# Altium project Carte_test_JLC.PrjPcb
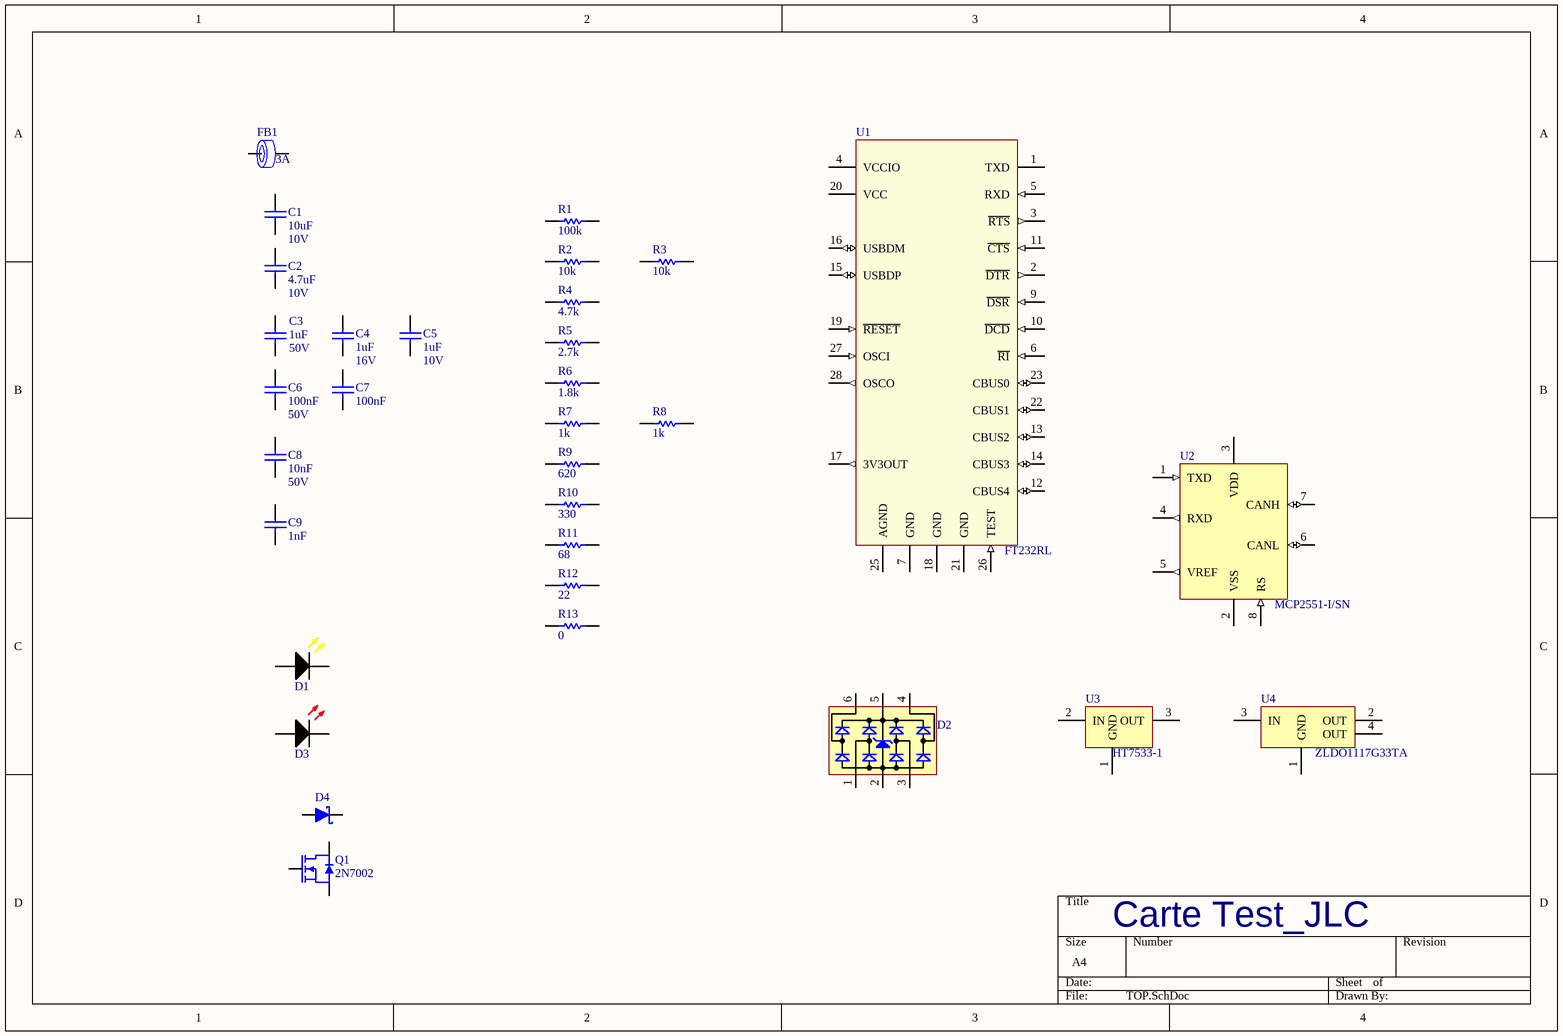
[diagram p0: TOP.SchDoc]
1 sheet, 32 parts. Net scope: global (net labels, ports and power ports of the same name join across sheets).
Board file: Carte_test_JLC.PcbDoc

## Sheet TOP.SchDoc
size A4; Author: Audran; CompanyName: Goldorak; Address1: Electrolab; Address2: 52 rue Paul Lescop; Address3: 92000 Nanterre; DocumentNumber: 1; SheetNumber: 1; SheetTotal: 8; ProjectName: Cartes_2017

### Parts
C1  10uF  RatedVoltage: 10V  [WCAP-CSGP_0805, 2x1.25x1.25]
C2  4.7uF  RatedVoltage: 10V  [WCAP-CSGP_0603, 1.6x0.8x0.8]
C3  1uF  RatedVoltage: 50V  [WCAP-CSGP_0805, 2x1.25x1.25]
C4  1uF  RatedVoltage: 16V  [WCAP-CSGP_0603, 1.6x0.8x0.8]
C5  1uF  RatedVoltage: 10V  [WCAP-CSGP_0402, 1x0.5x0.5]
C6  100nF  RatedVoltage: 50V  [WCAP-CSGP_0603, 1.6x0.8x0.8]
C7  100nF  [WCAP-CSGP_0402, 1x0.5x0.5]
C8  10nF  RatedVoltage: 50V  [WCAP-CSGP_0402, 1x0.5x0.5]
C9  1nF  [WCAP-CSGP_0402, 1x0.5x0.5]
D1  150060YS75000  [SMCW_0603]  (value not drawn)
D2  824001  [SOT-23-6L]  (value not drawn)
D3  150060RS75000  [SMCW_0603]  (value not drawn)
D4  RBR3MM40ATFTR  [SOD-123FL]  (value not drawn)
FB1  RatedCurrent: 3A  [WE-CBF_0805_High Current]  (hidden comment: 742792023)
Q1  2N7002  [SOT-23]
R1  value 100k  [RESC1005X04N]  (hidden comment: RC0402FR-07100KL)
R2  value 10k  [RESC1005X04N]  (hidden comment: RC0402FR-0710KL)
R3  value 10k  [RESC1608X06N]  (hidden comment: RC0603FR-0710KL)
R4  value 4.7k  [RESC1005X04N]  (hidden comment: RC0402FR-074K7L)
R5  value 2.7k  [RESC2012X06N]  (hidden comment: RC0805FR-072K7L)
R6  value 1.8k  [RESC1608X06N]  (hidden comment: RC0603FR-071K8L)
R7  value 1k  [RESC1005X04N]  (hidden comment: RC0402FR-071KL)
R8  value 1k  [RESC1608X06N]  (hidden comment: RC0603FR-071KL)
R9  value 620  [RESC1608X06N]  (hidden comment: RC0603FR-07620RL)
R10  value 330  [RESC1005X04N]  (hidden comment: RC0402FR-07330RL)
R11  value 68  [RESC1608X06N]  (hidden comment: RC0603FR-0768RL)
R12  value 22  [RESC1005X04N]  (hidden comment: RC0402FR-0722RL)
R13  value 0  [RESC1608X06N]  (hidden comment: RC0603FR-070RL)
U1  FT232RL  [SSOP28]
U2  MCP2551-I/SN  [SOIC127P600X175-8N]
U3  HT7533-1  [SOT89-150P350X160-3N]
U4  ZLDO1117G33TA  [SOT223]

### Nets

Not connected (* = marked no-connect by the designer): C1 1 2; C2 1 2; C3 1 2; C4 1 2; C5 1 2; C6 1 2; C7 1 2; C8 1 2; C9 1 2; D1 1(C) 2(A); D2 1 2 3 4 5 6; D3 1(C) 2(A); D4 1 2; FB1 1 2; Q1 1(G) 2(S) 3(D); R1 1 2; R2 1 2; R3 1 2; R4 1 2; R5 1 2; R6 1 2; R7 1 2; R8 1 2; R9 1 2; R10 1 2; R11 1 2; R12 1 2; R13 1 2; U1 1(TXD) 2(~{DTR}) 3(~{RTS}) 4(VCCIO) 5(RXD) 6(~{RI}) 7(GND) 9(~{DSR}) 10(~{DCD}) 11(~{CTS}) 12(CBUS4) 13(CBUS2) 14(CBUS3) 15(USBDP) 16(USBDM) 17(3V3OUT) 18(GND) 19(~{RESET}) 20(VCC) 21(GND) 22(CBUS1) 23(CBUS0) 25(AGND) 26(TEST) 27(OSCI) 28(OSCO); U2 1(TXD) 2(VSS) 3(VDD) 4(RXD) 5(VREF) 6(CANL) 7(CANH) 8(RS); U3 1(GND) 2(IN) 3(OUT); U4 1(GND) 2(OUT) 3(IN) 4(OUT)

### Notes on the sheet
- Carte Test_JLC

### Library data of the parts
C1 = WCAP-CSGP, 885012207026: CAP CER 10uF 10V X7R 0805; Manufacturer: Wurth Elektronik; ComponentLink1Description: Datasheet; ComponentLink1URL: http://katalog.we-online.com/pbs/datasheet/885012207026.pdf; Manufacturer Part Number: 885012207026; Value: 10uF; Size: 0805; CeramicType: X7R; Supplier 1: Farnell; Supplier Part Number 1: 2495189; Supplier Part Number 2: C15850; Supplier 2: JLCPCB; Supplier Footprint 2: 0805
C2 = WCAP-CSGP, 885012106012: CAP CER 4.7UF 10V X5R 0603; Manufacturer: Wurth Elektronik; ComponentLink1Description: Datasheet; ComponentLink1URL: http://katalog.we-online.com/pbs/datasheet/885012106012.pdf; Manufacturer Part Number: 885012106012; Value: 4.7uF; Size: 0603; CeramicType: X5R; Supplier 2: JLCPCB; Supplier Part Number 2: C19666; Supplier Footprint 2: 0603
C3 = WCAP-CSGP, 885012207103: CAP CER 1uF 50V X7R 0805; Manufacturer: Wurth Elektronik; ComponentLink1Description: Datasheet; ComponentLink1URL: http://katalog.we-online.com/pbs/datasheet/885012207103.pdf; Manufacturer Part Number: 885012207103; Value: 1uF; Size: 0805; CeramicType: X7R; Supplier 2: JLCPCB; Supplier Part Number 2: C28323; Supplier Footprint 2: 0805
C4 = WCAP-CSGP, 885012106017: CAP CER 1UF 16V X5R 0603; Manufacturer: Wurth Elektronik; ComponentLink1Description: Datasheet; ComponentLink1URL: http://katalog.we-online.com/pbs/datasheet/885012106017.pdf; Manufacturer Part Number: 885012106017; Value: 1uF; Size: 0603; CeramicType: X5R; Supplier 2: JLCPCB; Supplier Part Number 2: C15849; Supplier Footprint 2: 0603
C5 = WCAP-CSGP, 885012105012: CAP CER 1UF 10V X5R 0402; Manufacturer: Wurth Elektronik; ComponentLink1Description: Datasheet; ComponentLink1URL: http://katalog.we-online.com/pbs/datasheet/885012105012.pdf; Manufacturer Part Number: 885012105012; Value: 1uF; Size: 0402; CeramicType: X5R; Supplier 2: JLCPCB; Supplier Part Number 2: C52923; Supplier Footprint 2: 0402
C6 = WCAP-CSGP, 885012206095: CAP CER 100nF 50V X7R 0603; Manufacturer: Wurth Elektronik; ComponentLink1Description: Datasheet; ComponentLink1URL: http://katalog.we-online.com/pbs/datasheet/885012206095.pdf; Value: 100nF; Size: 0603; CeramicType: X7R; Manufacturer Part Number: 885012206095; Supplier 2: JLCPCB; Supplier Part Number 2: C14663; Supplier Footprint 2: 0603
C7 = WCAP-CSGP, 885012205037: CAP CER 100nF 16V X7R 0402; Manufacturer: Wurth Elektronik; ComponentLink1Description: Datasheet; ComponentLink1URL: http://katalog.we-online.com/pbs/datasheet/885012205037.pdf; Manufacturer Part Number: 885012205037; Value: 100nF; Size: 0402; CeramicType: X7R; RatedVoltage: 16V; Supplier 2: JLCPCB; Supplier Part Number 2: C1525; Supplier Footprint 2: 0402
C8 = WCAP-CSGP, 885012205067: CAP CER 10nF 50V X7R 0402; Manufacturer: Wurth Elektronik; ComponentLink1Description: Datasheet; ComponentLink1URL: http://katalog.we-online.com/pbs/datasheet/885012205067.pdf; Manufacturer Part Number: 885012205067; Value: 10nF; Size: 0402; CeramicType: X7R; Supplier 2: JLCPCB; Supplier Part Number 2: C15195; Supplier Footprint 2: 0402
C9 = WCAP-CSGP, 885012205061: CAP CER 1nF 50V X7R 0402; Manufacturer: Wurth Elektronik; ComponentLink1Description: Datasheet; ComponentLink1URL: http://katalog.we-online.com/pbs/datasheet/885012205061.pdf; Manufacturer Part Number: 885012205061; Value: 1nF; Size: 0402; CeramicType: X7R; RatedVoltage: 50V; Supplier 2: JLCPCB; Supplier Part Number 2: C1523; Supplier Footprint 2: 0402
D1 = WL-SMCW 0603  150060YS75000: SMD mono-color Chip LED, WL-SMCW, Yellow; Manufacturer: Wurth Elektronik; Value: Jaune; Manufacturer Part Number: 150060YS75000; ComponentLink1Description: Datasheet; ComponentLink1URL: http://katalog.we-online.com/led/datasheet/150060YS75000.pdf; Supplier 1: Farnell; Supplier Part Number 1: 2322074; Supplier 2: JLCPCB; Supplier Part Number 2: C72038; Supplier Footprint 2: LED_0603
D2 = 824001: WE-TVS TVS Diode 4+1Ch 5V SOT23-6L; Manufacturer: Wurth Elektronik; ComponentLink1Description: Datasheet; ComponentLink1URL: https://www.we-online.com/catalog/datasheet/824001.pdf; Manufacturer Part Number: 824001; Supplier 1: Farnell; Supplier Part Number 1: 1748613; Type: TVS; Value: 5V; Supplier 2: JLCPCB; Supplier Part Number 2: C85364; Supplier Footprint 2: SOT-23-6L
D3 = WL-SMCW 0603  150060RS75000: SMD mono-color Chip LED, WL-SMCW, Red; Manufacturer: Wurth Elektronik; Value: Rouge; Manufacturer Part Number: 150060RS75000; ComponentLink1Description: Datasheet; ComponentLink1URL: http://katalog.we-online.com/led/datasheet/150060RS75000.pdf; Supplier 1: Farnell; Supplier Part Number 1: 2322071; Supplier 2: JLCPCB; Supplier Part Number 2: C2286; Supplier Footprint 2: LED_0603
D4 = RBR3MM40ATFTR: DIODE SCHOTTKY 40V 3A SOD123-FL; Manufacturer: ROHM; Supplier 1: Farnell; Manufacturer Part Number: RBR3MM40ATFTR; ComponentLink1URL: http://www.farnell.com/datasheets/2067190.pdf; ComponentLink1Description: Datasheet; Supplier Part Number 1: 2581593; ComponentLink2Description: Manufacturer; ComponentLink2URL: http://www.rohm.com/web/global/products/-/product/RBR3MM40ATF; ContinuousForwardCurrent: 3A; Type: Schottky; Supplier 2: JLCPCB; Supplier Part Number 2: C8598; Value: 40V; Supplier Footprint 2: SOD-123
FB1 = WE-CBF, 742792023: Ferrite Bead 120ohm 0805 3A; Manufacturer: Wurth Elektronik; Value: 120; ComponentLink1Description: Manufacturer; ComponentLink1URL: https://www.we-online.com/catalog/en/WE-CBF/?sq=742792023#742792023; ComponentLink2Description: Datasheet; ComponentLink2URL: https://www.we-online.com/catalog/datasheet/742792023.pdf; Manufacturer Part Number: 742792023; Supplier 2: JLCPCB; Supplier Part Number 2: C1015; Supplier 1: Farnell; Supplier Part Number 1: 1635732; Supplier Footprint 2: 0805
Q1 = 2N7002: MOSFET N 60V 115MA SOT23; Manufacturer: Changjiang Electronics Tech (CJ); Supplier 1: Farnell; Supplier Part Number 1: 1510761; Manufacturer Part Number: 2N7002; ComponentLink1Description: Datasheet; ComponentLink1URL: https://datasheet.lcsc.com/szlcsc/1810151612_Changjiang-Electronics-Tech-CJ-2N7002_C8545.pdf; Supplier 2: JLCPCB; Supplier Part Number 2: C8545; Supplier Footprint 2: SOT-23-3
R1 = RC0402FR-07100KL: RES SMD 100K OHM 1% 1/16W 0402; Manufacturer: Yageo; Power: 63mW; Vmax: 50V; Type: Thick Film; ComponentLink1Description: Manufacturer; ComponentLink1URL: http://www.yageo.com/NewPortal/_en/index.jsp; ComponentLink2Description: Datasheet; ComponentLink2URL: http://www.farnell.com/datasheets/2167052.pdf; Manufacturer Part Number: RC0402FR-07100KL; Supplier 1: Farnell; Supplier Part Number 1: 9239472; Precision: ±1%; Supplier 2: JLCPCB; Supplier Part Number 2: C25741; Supplier Footprint 2: 0402
R2 = RC0402FR-0710KL: RES SMD 10K OHM 1% 1/16W 0402; Manufacturer: Yageo; Power: 63mW; Vmax: 50V; Type: Thick Film; ComponentLink1Description: Manufacturer; ComponentLink1URL: http://www.yageo.com/NewPortal/_en/index.jsp; ComponentLink2Description: Datasheet; ComponentLink2URL: http://www.farnell.com/datasheets/2167052.pdf; Supplier 1: Farnell; Supplier Part Number 1: 9239359; Manufacturer Part Number: RC0402FR-0710KL; Precision: ±1%; Supplier 2: JLCPCB; Supplier Part Number 2: C25744; Supplier Footprint 2: 0402
R3 = RC0603FR-0710KL: RES SMD 10K OHM 1% 1/10W 0603; Manufacturer: Yageo; Power: 100mW; Vmax: 50V; Manufacturer Part Number: RC0603FR-0710KL; Type: Thick Film; ComponentLink1Description: Manufacturer; ComponentLink1URL: http://www.yageo.com/NewPortal/_en/index.jsp; ComponentLink2Description: Datasheet; ComponentLink2URL: http://www.farnell.com/datasheets/2167052.pdf; Supplier 1: Farnell; Supplier Part Number 1: 9238603; Precision: ±1%; Supplier 2: JLCPCB; Supplier Part Number 2: C25804; Supplier Footprint 2: 0603
R4 = RC0402FR-074K7L: RES SMD 4K7 OHM 1% 1/16W 0402; Manufacturer: Yageo; Power: 63mW; Vmax: 50V; Type: Thick Film; ComponentLink1Description: Manufacturer; ComponentLink1URL: http://www.yageo.com/NewPortal/_en/index.jsp; ComponentLink2Description: Datasheet; ComponentLink2URL: http://www.farnell.com/datasheets/2167052.pdf; Manufacturer Part Number: RC0402FR-074K7L; Supplier 1: Farnell; Supplier Part Number 1: 9239316; Precision: ±1%; Supplier 2: JLCPCB; Supplier Part Number 2: C25900; Supplier Footprint 2: 0402
R5 = RC0805FR-072K7L: RES SMD 2K7 OHM 1% 1/8W 0805; Manufacturer: Yageo; Power: 125mW; Vmax: 50V; Manufacturer Part Number: RC0805FR-072K7L; Type: Thick Film; ComponentLink1Description: Manufacturer; ComponentLink1URL: http://www.yageo.com/NewPortal/_en/index.jsp; ComponentLink2Description: Datasheet; ComponentLink2URL: http://www.farnell.com/datasheets/444164.pdf; Supplier 1: Farnell; Supplier Part Number 1: 9237666; Precision: ±1%; Supplier 2: JLCPCB; Supplier Part Number 2: C17530; Supplier Footprint 2: 0805
R6 = RC0603FR-071K8L: RES SMD 1.8K OHM 1% 1/10W 0603; Manufacturer: Yageo; Power: 100mW; Vmax: 50V; Manufacturer Part Number: RC0603FR-071K8L; Type: Thick Film; ComponentLink1Description: Manufacturer; ComponentLink1URL: http://www.yageo.com/NewPortal/_en/index.jsp; ComponentLink2Description: Datasheet; ComponentLink2URL: http://www.farnell.com/datasheets/2167052.pdf; Precision: ±1%; Supplier 1: Farnell; Supplier Part Number 1: 9238514; Supplier 2: JLCPCB; Supplier Part Number 2: C4177; Supplier Footprint 2: 0603
R7 = RC0402FR-071KL: RES SMD 1K OHM 1% 1/16W 0402; Manufacturer: Yageo; Power: 63mW; Vmax: 50V; Type: Thick Film; ComponentLink1Description: Manufacturer; ComponentLink1URL: http://www.yageo.com/NewPortal/_en/index.jsp; ComponentLink2Description: Datasheet; ComponentLink2URL: http://www.farnell.com/datasheets/2167052.pdf; Manufacturer Part Number: RC0402FR-071KL; Supplier 1: Farnell; Supplier Part Number 1: 9239235; Precision: ±1%; Supplier 2: JLCPCB; Supplier Part Number 2: C11702; Supplier Footprint 2: 0402
R8 = RC0603FR-071KL: RES SMD 1K OHM 1% 1/10W 0603; Manufacturer: Yageo; Power: 100mW; Vmax: 50V; Manufacturer Part Number: RC0603FR-071KL; Type: Thick Film; ComponentLink1Description: Manufacturer; ComponentLink1URL: http://www.yageo.com/NewPortal/_en/index.jsp; ComponentLink2Description: Datasheet; ComponentLink2URL: http://www.farnell.com/datasheets/2167052.pdf; Precision: ±1%; Supplier 1: Farnell; Supplier Part Number 1: 9238484; Supplier 2: JLCPCB; Supplier Part Number 2: C21190; Supplier Footprint 2: 0603
R9 = RC0603FR-07620RL: RES SMD 620 OHM 1% 1/10W 0603; Manufacturer: Yageo; Power: 100mW; Vmax: 50V; Type: Thick Film; ComponentLink1Description: Manufacturer; ComponentLink1URL: http://www.yageo.com/NewPortal/_en/index.jsp; ComponentLink2Description: Datasheet; ComponentLink2URL: http://www.farnell.com/datasheets/1868787.pdf; Manufacturer Part Number: RC0603FR-07620RL; Precision: ±1%; Supplier 1: Digi-Key; Supplier Part Number 1: 311-620HRCT-ND; Supplier 2: JLCPCB; Supplier Part Number 2: C23220; Supplier Footprint 2: 0603
R10 = RC0402FR-07330RL: RES SMD 330 OHM 1% 1/16W 0402; Manufacturer: Yageo; Power: 63mW; Vmax: 50V; Type: Thick Film; ComponentLink1Description: Manufacturer; ComponentLink1URL: http://www.yageo.com/NewPortal/_en/index.jsp; ComponentLink2Description: Datasheet; ComponentLink2URL: http://www.farnell.com/datasheets/2167052.pdf; Manufacturer Part Number: RC0402FR-07330RL; Supplier 1: Farnell; Supplier Part Number 1: 9239170; Precision: ±1%; Supplier 2: JLCPCB; Supplier Part Number 2: C25104; Supplier Footprint 2: 0402
R11 = RC0603FR-0768RL: RES SMD 68 OHM 1% 1/10W 0603; Manufacturer: Yageo; Power: 100mW; Vmax: 50V; Manufacturer Part Number: RC0603FR-0768RL; Type: Thick Film; ComponentLink1Description: Manufacturer; ComponentLink1URL: http://www.yageo.com/NewPortal/_en/index.jsp; ComponentLink2Description: Datasheet; ComponentLink2URL: http://www.farnell.com/datasheets/1868787.pdf; Supplier 1: Farnell; Supplier Part Number 1: 9238344; Precision: ±1%; Supplier 2: JLCPCB; Supplier Part Number 2: C27592; Supplier Footprint 2: 0603
R12 = RC0402FR-0722RL: RES SMD 22 OHM 1% 1/16W 0402; Manufacturer: Yageo; Power: 63mW; Vmax: 50V; Type: Thick Film; ComponentLink1Description: Manufacturer; ComponentLink1URL: http://www.yageo.com/NewPortal/_en/index.jsp; ComponentLink2Description: Datasheet; ComponentLink2URL: http://www.farnell.com/datasheets/2167052.pdf; Manufacturer Part Number: RC0402FR-0722RL; Supplier 1: Farnell; Supplier Part Number 1: 9239030; Precision: ±1%; Supplier 2: JLCPCB; Supplier Part Number 2: C25092; Supplier Footprint 2: 0402
R13 = RC0603FR-070RL: RES SMD 0 OHM 1% 1/10W 0603; Manufacturer: Yageo; Power: 100mW; Vmax: 50V; Manufacturer Part Number: RC0603FR-070RL; Type: Thick Film; ComponentLink1Description: Manufacturer; ComponentLink1URL: http://www.yageo.com/NewPortal/_en/index.jsp; ComponentLink2Description: Datasheet; ComponentLink2URL: http://www.farnell.com/datasheets/2167052.pdf; Supplier 1: Farnell; Precision: ±1%; Supplier Part Number 1: 2309106; Supplier 2: JLCPCB; Supplier Part Number 2: C21189; Supplier Footprint 2: 0603
U1 = FT232RL: USB VERS UART CMS SSOP28 232; Manufacturer: FTDI; Manufacturer Part Number: FT232RL; Supplier 1: Farnell; Supplier Part Number 1: 1146032; ComponentLink1Description: Datasheet; ComponentLink1URL: http://www.farnell.com/datasheets/2007793.pdf; Supplier 2: JLCPCB; Supplier Footprint 2: SSOP-28_5.3x10.2x0.65P; Supplier Part Number 2: C8690
U2 = MCP2551-I/SN: IC TRANSCEIVER CAN HI-SPD 8-SOIC; Manufacturer: Microchip Technology; Manufacturer Part Number: MCP2551-I/SN; ComponentLink1Description: Datasheet; ComponentLink1URL: http://www.farnell.com/datasheets/657417.pdf; Supplier 1: Farnell; Supplier Part Number 1: 9758569; Supplier 2: JLCPCB; Supplier Part Number 2: C7439; Supplier Footprint 2: SOIC-8_3.9x4.9x1.27P
U3 = HT7533-1: LDO 3.3V 100mA SOT89; Manufacturer: Holtek; Manufacturer Part Number: HT7533-1; ComponentLink1URL: https://datasheet.lcsc.com/szlcsc/1812071811_Holtek-Semicon-HT7533-1_C14289.pdf; ComponentLink1Description: Datasheet; ComponentLink2Description: Manufacturer; ComponentLink2URL: https://www.holtek.com/productdetail/-/vg/75xx_1; Type: LDO; Value: 3.3V; Supplier 1: RSComponents; Supplier Part Number 1: 8850721; Supplier 2: JLCPCB; Supplier Part Number 2: C14289; Supplier Footprint 2: SOT-89-3
U4 = ZLDO1117G33TA: LDO 3.3V 1A SOT223-3; Manufacturer: Diodes Inc.; Manufacturer Part Number: ZLDO1117G33TA; ComponentLink1URL: http://www.farnell.com/datasheets/1769101.pdf; ComponentLink1Description: Datasheet; ComponentLink2Description: Manufacturer; ComponentLink2URL: https://www.diodes.com/part/view/ZLDO1117; Type: LDO; Value: 3.3V; Supplier 2: JLCPCB; Supplier Part Number 2: C6186; Supplier 1: Farnell; Supplier Part Number 1: 1825376; Supplier Footprint 2: SOT-223

## Assembly variants
PROD: not fitted FB206 FB207 FB208 FB209 R205 R206 R269 R274 R275 R281 R286 R287 R323 R324 R325 R326 R327 R343 R344 R345 R346 R347 R348 R349 R350 R360 R361 R362 R363 R366 R367 R377 R378 R404 R405; alternate parts R270 -> RC0603FR-071K8L, R282 -> RC0603FR-071K8L, R277 -> RC0603FR-071K8L, R276 -> RC0603FR-071K8L, R289 -> RC0603FR-071K8L, R288 -> RC0603FR-071K8L